# Altium schematic sheet boxer_supply.SchDoc: Power and Supply (+5V, -5V, +3.3V)
size A4; DrawnBy: Damian Dolewski; Engineer: Damian Dolewski; DocumentNumber: 6; SheetNumber: 6; SheetTotal: 7
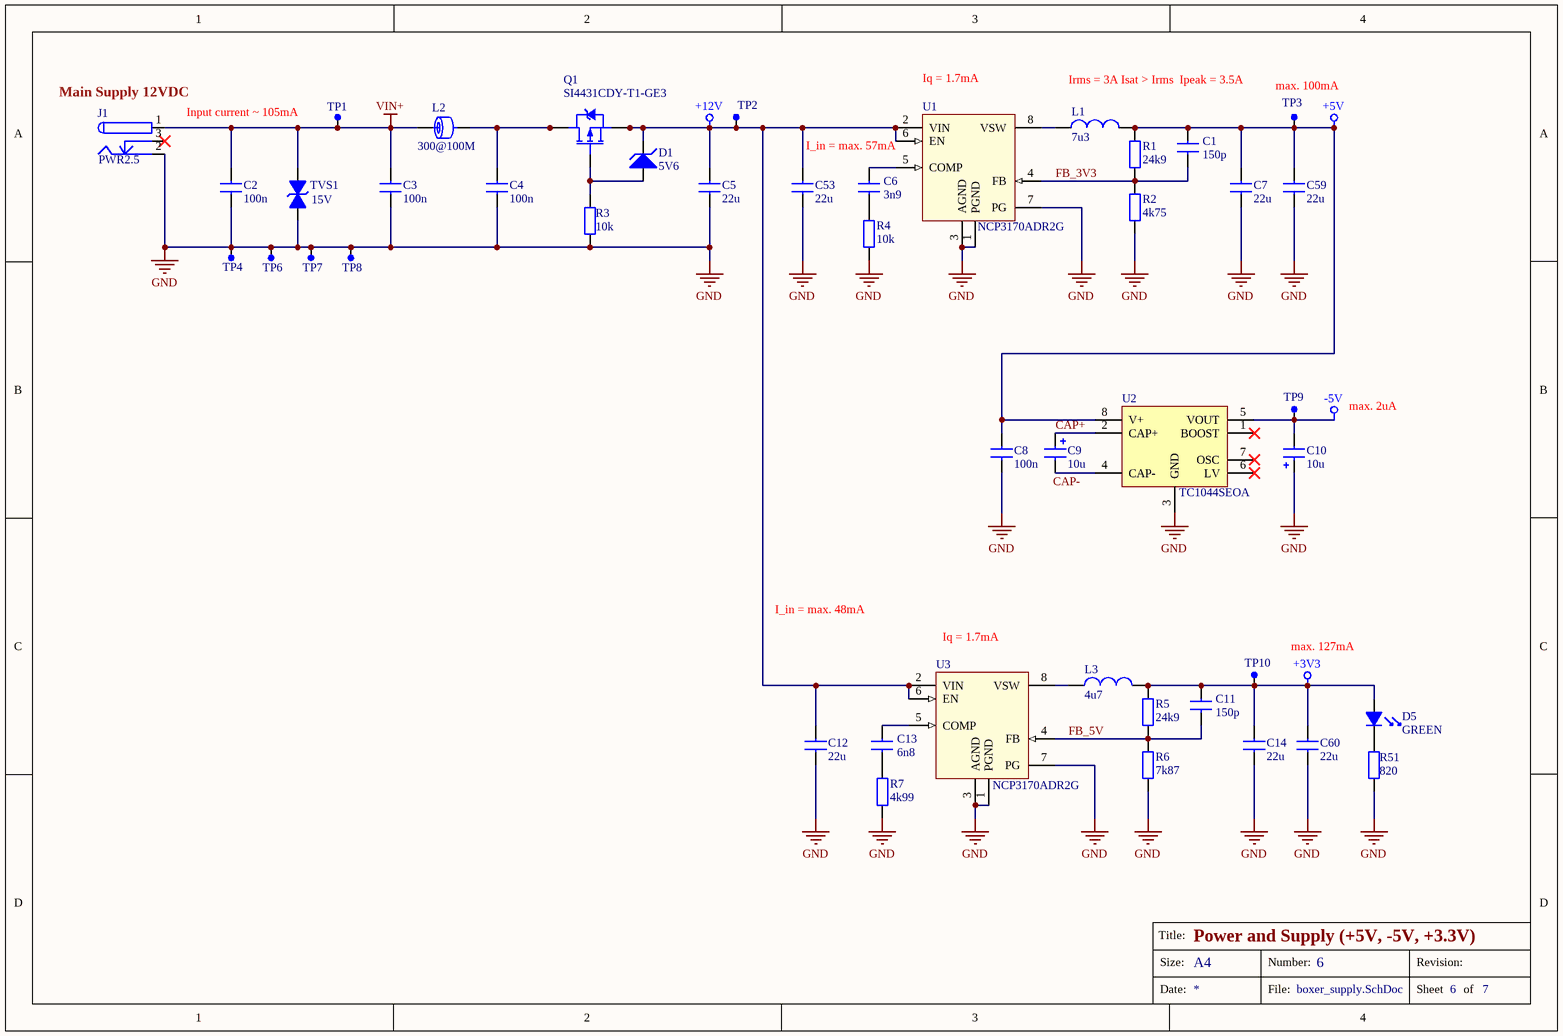
[diagram p0: boxer_supply.SchDoc]

## Parts
C1  value 150p  [C_0805]  (hidden comment: 885012207081)
C2  value 100n  [C_0805]  (hidden comment: Capacitor)
C3  value 100n  [C_0805]  (hidden comment: Capacitor)
C4  value 100n  [C_0805]  (hidden comment: Capacitor)
C5  value 22u  [C_1206]  (hidden comment: TME: CL31A226MOCLNNC)
C6  value 3n9  [C_0805]  (hidden comment: 885012207089)
C7  value 22u  [C_1206]  (hidden comment: TME: CL31A226MOCLNNC)
C8  value 100n  [C_0805]  (hidden comment: Capacitor)
C9  value 10u  [C_SMC]  (hidden comment: TAJC106K016R)
C10  value 10u  [C_SMC]  (hidden comment: TAJC106K016R)
C11  value 150p  [C_0805]  (hidden comment: 885012207081)
C12  value 22u  [C_1206]  (hidden comment: TME: CL31A226MOCLNNC)
C13  value 6n8  [C_0805]  (hidden comment: 885012207091)
C14  value 22u  [C_1206]  (hidden comment: TME: CL31A226MOCLNNC)
C53  value 22u  [C_1206]  (hidden comment: TME: CL31A226MOCLNNC)
C59  value 22u  [C_1206]  (hidden comment: TME: CL31A226MOCLNNC)
C60  value 22u  [C_1206]  (hidden comment: TME: CL31A226MOCLNNC)
D1  value 5V6  [D_SMA]  (hidden comment: MM3Z5V6B)
D5  value GREEN  [LED_0805]  (hidden comment: KP-2012LSGC)
J1  PWR2.5  [WE_WR_DC_694106301002]
L1  value 7u3  [L_6.7x6.7mm]  (hidden comment: 308-1500-1-ND)
L2  value 300@100M  [L_0805]  (hidden comment: 742792031)
L3  value 4u7  [L_3.8x3.8mm]  (hidden comment: 732-1008-1-ND)
Q1  SI4431CDY-T1-GE3  [SO8]
R1  value 24k9  [R_0805]  (hidden comment: RNCP0805FTD24K9)
R2  value 4k75  [R_0805]  (hidden comment: RNCP0805FTD4K75)
R3  value 10k  [R_1206]  (hidden comment: Resistor)
R4  value 10k  [R_1206]  (hidden comment: Resistor)
R5  value 24k9  [R_0805]  (hidden comment: RNCP0805FTD24K9)
R6  value 7k87  [R_0805]  (hidden comment: RC0805FR-077K87L)
R7  value 4k99  [R_0805]  (hidden comment: RMCF0805FT4K99)
R51  value 820  [R_0805]  (hidden comment: Resistor)
TP1  TEST PAD  [PIN]  (value not drawn)
TP2  TEST PAD  [PIN]  (value not drawn)
TP3  TEST PAD  [PIN]  (value not drawn)
TP4  TEST PAD  [PIN]  (value not drawn)
TP6  TEST PAD  [PIN]  (value not drawn)
TP7  TEST PAD  [PIN]  (value not drawn)
TP8  TEST PAD  [PIN]  (value not drawn)
TP9  TEST PAD  [PIN]  (value not drawn)
TP10  TEST PAD  [PIN]  (value not drawn)
TVS1  value 15V  [D_SMB]  (hidden comment: SM6T15CA)
U1  NCP3170ADR2G  [SO8]
U2  TC1044SEOA  [SO8]
U3  NCP3170ADR2G  [SO8]

## Nets
+3V3: C11.2 C14.2 C60.2 D5.1(A) L3.2 R5.2 TP10.1
+5V: C1.2 C7.2 C8.2 C59.2 L1.2 R1.2 TP3.1 U2.8(V+)
+12V: C5.2 C12.2 C53.2 D1.2(K) Q1.1(S) Q1.2(S) Q1.3(S) TP2.1 U1.2(VIN) U1.6(EN) U3.2(VIN) U3.6(EN)
-5V: C10.2 TP9.1 U2.5(VOUT)
GND: C2.1 C3.1 C4.1 C5.1 C7.1 C8.1 C10.1 C12.1 C14.1 C53.1 C59.1 C60.1 J1.2 R2.1 R3.1 R4.1 R6.1 R7.1 R51.1 TP4.1 TP6.1 TP7.1 TP8.1 TVS1.1(A) U1.1(PGND) U1.3(AGND) U1.7(PG) U2.3(GND) U3.1(PGND) U3.3(AGND) U3.7(PG)
VIN+: C2.2 C3.2 J1.1 L2.1 TP1.1 TVS1.2(K)
CAP+: C9.1 U2.2(CAP+)
CAP-: C9.2 U2.4(CAP-)
FB_3V3: C1.1 R1.1 R2.2 U1.4(FB)
FB_5V: C11.1 R5.1 R6.2 U3.4(FB)
NetC4_2: C4.2 L2.2 Q1.5(D) Q1.6(D) Q1.7(D) Q1.8(D)
NetC6_1: C6.1 R4.2
NetC6_2: C6.2 U1.5(COMP)
NetC13_1: C13.1 R7.2
NetC13_2: C13.2 U3.5(COMP)
NetD1_1: D1.1(A) Q1.4(G) R3.2
NetD5_2: D5.2(K) R51.2
NetL1_1: L1.1 U1.8(VSW)
NetL3_1: L3.1 U3.8(VSW)

Not connected (* = marked no-connect by the designer): J1 3*; U2 1(BOOST)* 6(LV)* 7(OSC)*

## Notes on the sheet
- (near J1) Main Supply 12VDC
- Input current ~ 105mA
- (near U1) Iq = 1.7mA
- Irms = 3A Isat > Irms  Ipeak = 3.5A
- (near TP3) max. 100mA
- I_in = max. 57mA
- max. 2uA
- I_in = max. 48mA
- (near U3) Iq = 1.7mA
- max. 127mA
- Title:
- Size:
- A4
- Number:
- Revision:
- Date:
- File:
- Sheet
- of

## Library data of the parts
C1 C5-C7 C11-C14 C53 C59 C60 = Capacitor
C9 C10 = Capacitor Polar: Polarized Capacitor
D1 = Diode Zener: Zener Diode
D5 = LED: Typical RED, GREEN, YELLOW, AMBER GaAs LED
J1 = PWR2.5: Low Voltage Power Supply Connector; ComponentLink1Description: Manufacturer Link; ComponentLink1URL: http://domino.kycon.com/internet/Products.html; Value: PWR2.5
L1 = Inductor: FIXED IND 7.3UH 2.1A 54 MOHM SMD
L2 = FB: Ferrite Bead
L3 = Inductor: FIXED IND 4.7UH 1.2A 105 MOHM
Q1 = MOSFET-P_SO8: P-Channel MOSFET; Value: SI4431CDY-T1-GE3
R1 R2 R5-R7 = Resistor
TP1-TP4 TP6-TP10 = TEST_PAD: PAD 1.5mm
TVS1 = Transil
U1 U3 = NCP3170: Synchronous PWM Switching Converter; Value: NCP3170ADR2G
U2 = TC1044S: Charge Pump DC-TO-DC Voltage Converter; Value: TC1044SEOA